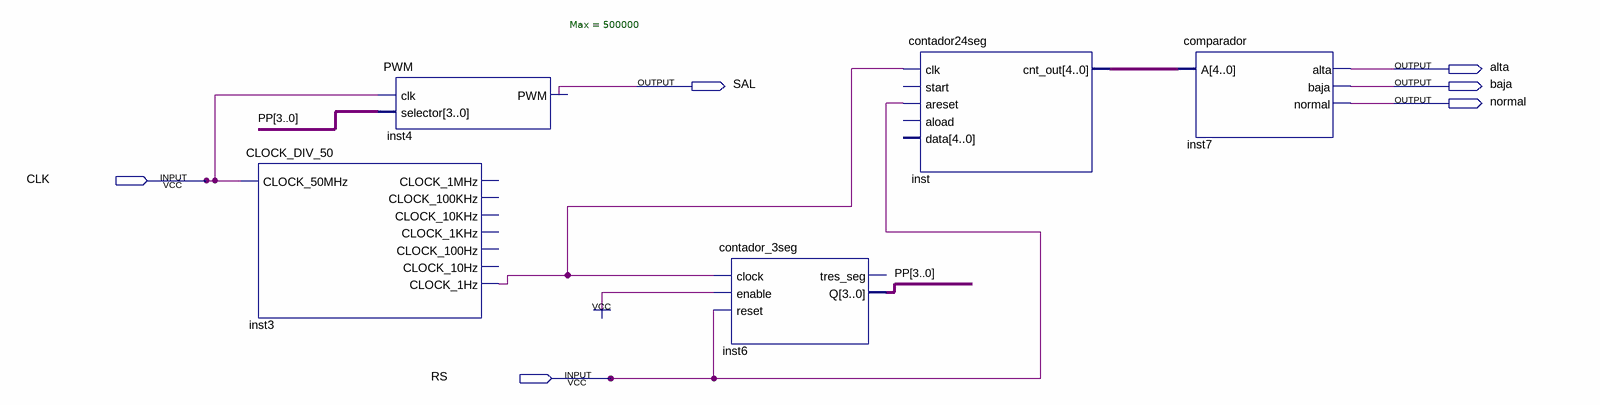
[diagram p0: schematic sheet]
// Quartus schematic KK.bdf as structural Verilog: 5 symbols, 6 pins
module KK (
  input  CLK,
  input  RS,
  output alta,
  output SAL,
  output baja,
  output normal
);

  wire inst3_clock_1hz;
  wire [3:0] PP;
  wire [4:0] inst_cnt_out;

  CLOCK_DIV_50 inst3 (
    .CLOCK_50MHz(CLK), .CLOCK_1Hz(inst3_clock_1hz));  // open: CLOCK_1MHz, CLOCK_100KHz, CLOCK_10KHz, CLOCK_1KHz, CLOCK_100Hz, CLOCK_10Hz
  PWM #(.Max(500000)) inst4 (.clk(CLK), .selector(PP), .PWM(SAL));
  contador_3seg inst6 (.clock(inst3_clock_1hz), .enable(1'b1), .reset(RS), .Q(PP));  // open: tres_seg
  contador24seg inst (.clk(inst3_clock_1hz), .areset(RS), .cnt_out(inst_cnt_out));  // open: start, aload, data
  comparador inst7 (.A(inst_cnt_out), .alta(alta), .baja(baja), .normal(normal));
endmodule
